# Altium schematic sheet Power Rails.SchDoc
size A4; SheetNumber: 2; SheetTotal: 4
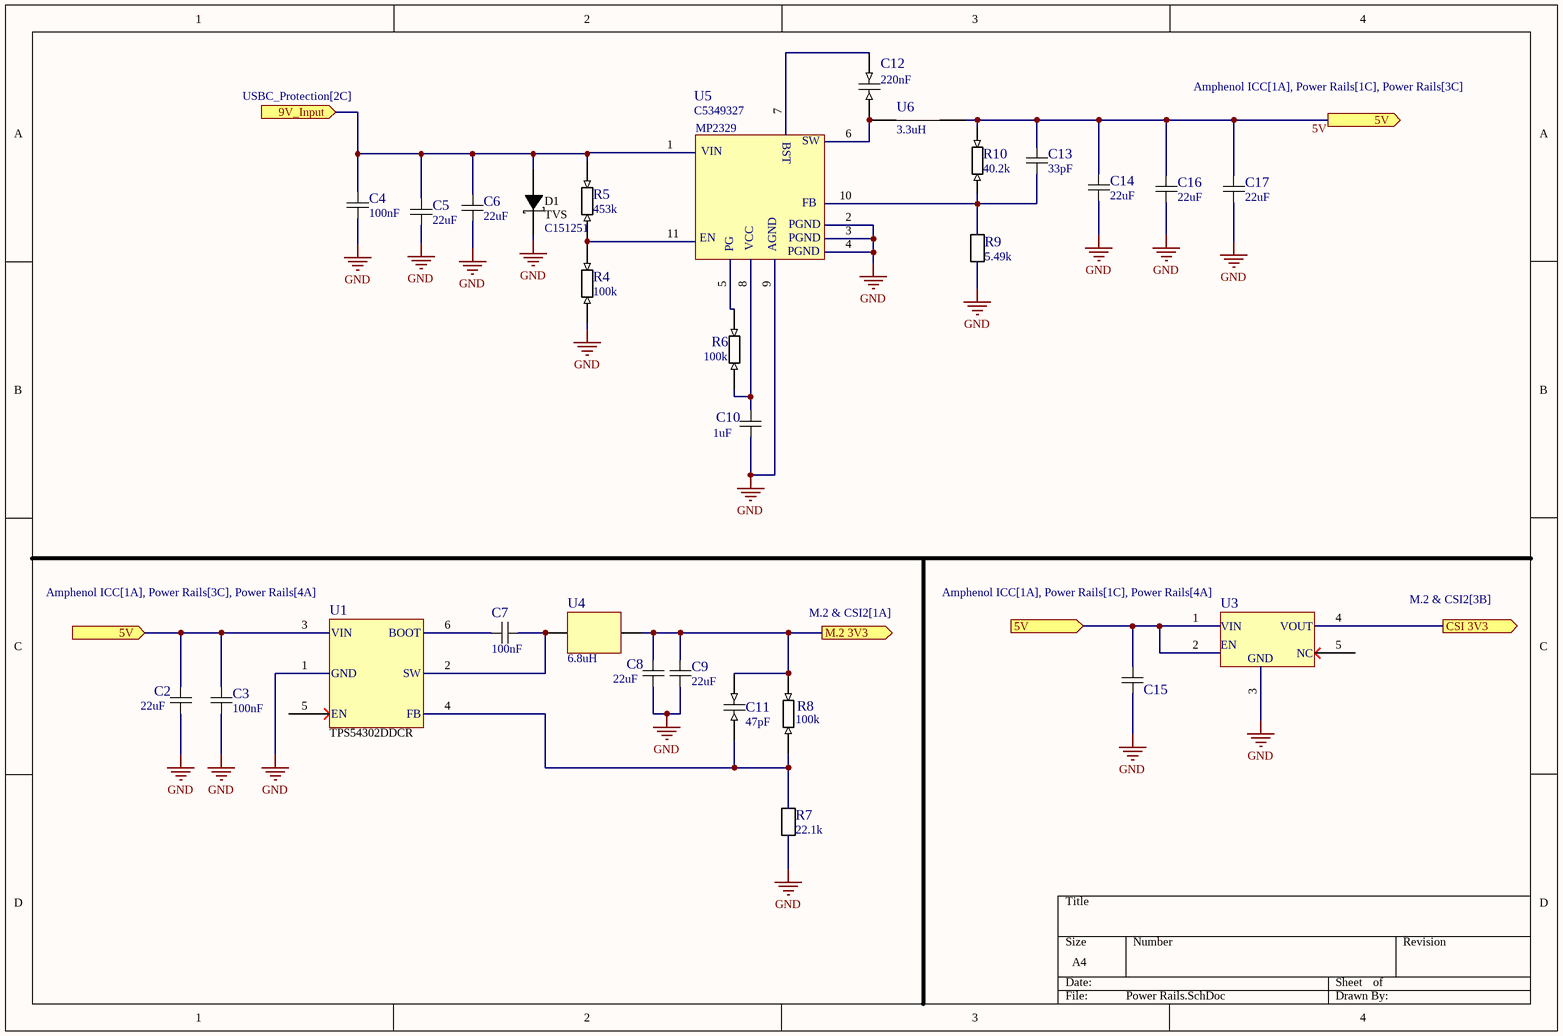
[diagram p0: Power Rails.SchDoc]

## Parts
C2  value 22uF  [C0805]  (hidden comment: CL21A226MAQNNNE)
C3  value 100nF  [C0603]  (hidden comment: CC0603KRX7R9BB104)
C4  value 100nF  [C0603]  (hidden comment: C0603X7R104K250NT)
C5  value 22uF  [C0805]  (hidden comment: CL21A226MAQNNNE)
C6  value 22uF  [C0805]  (hidden comment: CL21A226MAQNNNE)
C7  value 100nF  [C0603]  (hidden comment: CC0603KRX7R9BB104)
C8  value 22uF  [C0805]  (hidden comment: CL21A226MAQNNNE)
C9  value 22uF  [C0805]  (hidden comment: CL21A226MAQNNNE)
C10  value 1uF  [C0603]  (hidden comment: CL10A105KB8NNNC)
C11  value 47pF  [C0603]  (hidden comment: CL10C470JB8NNNC)
C12  value 220nF  [C0603]  (hidden comment: CL10B224KA8NNNC)
C13  value 33pF  [C0603]  (hidden comment: TCC0603COG330F500CT)
C14  value 22uF  [C0805]  (hidden comment: CL21A226MAQNNNE)
C15  CL10A105KB8NNNC  [C0603]  (value not drawn)
C16  value 22uF  [C0805]  (hidden comment: CL21A226MAQNNNE)
C17  value 22uF  [C0805]  (hidden comment: CL21A226MAQNNNE)
D1  TVS  Name: C151251  [SMB_L4.6-W3.6-LS5.3-RD]
R4  value 100k  [R0603]  (hidden comment: 0603WAF1003T5E)
R5  value 453k  [R0603]  (hidden comment: 0603WAF4533T5E)
R6  value 100k  [R0603]  (hidden comment: 0603WAF1003T5E)
R7  value 22.1k  [R0603]  (hidden comment: RT0603BRD0722K1L)
R8  value 100k  [R0603]  (hidden comment: 0603WAF1003T5E)
R9  value 5.49k  [R0603]  (hidden comment: FRQ0603F5491TS)
R10  value 40.2k  [R0603]  (hidden comment: 0603WAF4022T5E)
U1  TPS54302DDCR  [SOT-23-6_L2.9-W1.6-P0.95-LS2.8-BL]
U3  AP2112K-3.3TRG1  [SOT-25-5_L2.9-W1.6-P0.95-LS2.8-BL]  (value not drawn)
U4  value 6.8uH  [IND-SMD_L5.7-W5.2]  (hidden comment: CXP0530-6R8M-AG(6.8uh))
U5  Name: C5349327  [QFN-11_L2.0-W2.0-P0.50_MP2384CGG-Z]  (hidden comment: MP2329GG-Z)
U6  value 3.3uH  [IND-SMD_L13.8-W12.8]  (hidden comment: CYA1250-3.3UH)

## Ports
5V (in, see Amphenol ICC[1A], Power Rails[1C], Power Rails[4A]), 5V (in, see Amphenol ICC[1A], Power Rails[3C], Power Rails[4A]), 5V (out, see Amphenol ICC[1A], Power Rails[1C], Power Rails[3C]), 9V_Input (in, see USBC_Protection[2C]), CSI 3V3 (out, see M.2 & CSI2[3B]), M.2 3V3 (out, see M.2 & CSI2[1A])

## Nets
GND: C2.2 C3.1 C4.1 C5.1 C6.1 C8.2 C9.2 C10.1 C14.2 C15.1 C16.2 C17.2 D1.1(K) R4.1 R7.1 R9.1 U1.1(GND) U3.3 U5.2 U5.3 U5.4 U5.9
5V: C2.1 C3.2 C13.2 C14.1 C15.2 C16.1 C17.1 R10.2 U1.3(VIN) U3.1(VIN) U3.2(EN) U6.2 ; port 5V
9V_Input: C4.2 C5.2 C6.2 D1.2(A) R5.2 U5.1 ; port 9V_Input
CSI 3V3: U3.4 ; port CSI 3V3
M.2 3V3: C8.1 C9.1 C11.2 R8.2 U4.2 ; port M.2 3V3
NetC7_1: C7.1 U1.2(SW) U4.1
NetC7_2: C7.2 U1.6(BOOT)
NetC10_2: C10.2 R6.1 U5.8
NetC11_1: C11.1 R7.2 R8.1 U1.4(FB)
NetC12_1: C12.1 U5.6 U6.1
NetC12_2: C12.2 U5.7
NetC13_1: C13.1 R9.2 R10.1 U5.10
NetR4_2: R4.2 R5.1 U5.11
NetR6_2: R6.2 U5.5

Not connected (* = marked no-connect by the designer): U1 5(EN)*; U3 5*

## Notes on the sheet
- (in symbol AP2112K-3.3TRG1) VOUT; NC; GND
- (in symbol MP2329GG-Z) MP2329; BST; SW; VIN; FB; PGND; EN; VCC; PG; AGND

## Library data of the parts
C2 C5 C6 C8 C9 C14 C16 C17 = CL21A226MAQNNNE: 22uF ±20% 25V Ceramic Capacitor X5R 0805; Name: C45783; Source: LCSC
C3 C7 = CC0603KRX7R9BB104: 100nF ±10% 50V Ceramic Capacitor X7R 0603; Name: C14663; Source: LCSC
C4 = C0603X7R104K250NT: Name: C466768; Source: LCSC
C10 C15 = CL10A105KB8NNNC: 1uF ±10% 50V Ceramic Capacitor X5R 0603; Name: C15849; Source: LCSC
  C15: Value: 1uF
C11 = CL10C470JB8NNNC: 47pF ±5% 50V Ceramic Capacitor C0G 0603; Name: C1671; Source: LCSC
C12 = CL10B224KA8NNNC: 220nF ±10% 25V Ceramic Capacitor X7R 0603; Name: C21120; Source: LCSC
C13 = TCC0603COG330F500CT: 33pF C0G ±1% 50V 0603 Ceramic Capacitors; Name: C48543706; Source: LCSC
D1 = SMBJ12A_C151251: 21.5VC Clamp 28A@10/1000us Ipp TVS DIODE DO-214AA; Source: LCSC
R4 R6 R8 = 0603WAF1003T5E: 100kÎ© Â±1% 100mW 0603 Thick Film Resistor; Name: C25803; Source: LCSC
R5 = 0603WAF4533T5E: 453kÎ© Â±1% 100mW 0603 Thick Film Resistor; Name: C25818; Source: LCSC
R7 = RT0603BRD0722K1L: 22.1kÎ© 100mW 75V Thin Film Resistor Â±25ppm/â„ƒ Â±0.1% 0603 Chip Resistor - Surface Mount RoHS; Name: C723484; Source: LCSC
R9 = FRQ0603F5491TS: 5.49kÎ© 100mW 75V Thick Film Resistor Â±100ppm/â„ƒ Â±1% 0603 Chip Resistor - Surface Mount; Name: C54102278; Source: LCSC
R10 = 0603WAF4022T5E: 40.2kÎ© Â±1% 100mW 0603 Thick Film Resistor; Name: C12447; Source: LCSC
U1 = TPS54302DDCR_C311983: Buck Switching Regulator IC Adjustable 1 Output 3A TSOT-23-6; Source: LCSC; Name: C311983
U3 = AP2112K-3.3TRG1: 3.3V Positive Fixed SOT-25-5 Voltage Regulators - Linear, Low Drop Out (LDO) Regulators RoHS; Name: C51118; Source: LCSC
U4 = CXP0530-6R8M-AG_6.8UH: 3.5A 6.8uH Â±20% 5A 70mÎ© Molded inductor SMD,5.7x5.2mm Fixed Inductors; Name: C7461350; Source: LCSC
U6 = CYA1250-3.3UH: 20A 3.3uH ±20% 32A Molded inductor SMD,13.8x12.8mm Fixed Inductors; Name: C19268654; Source: LCSC
U5 = MP2329GG-Z: Source: LCSC